# Altium schematic sheet LedSnake.SchDoc
size A4
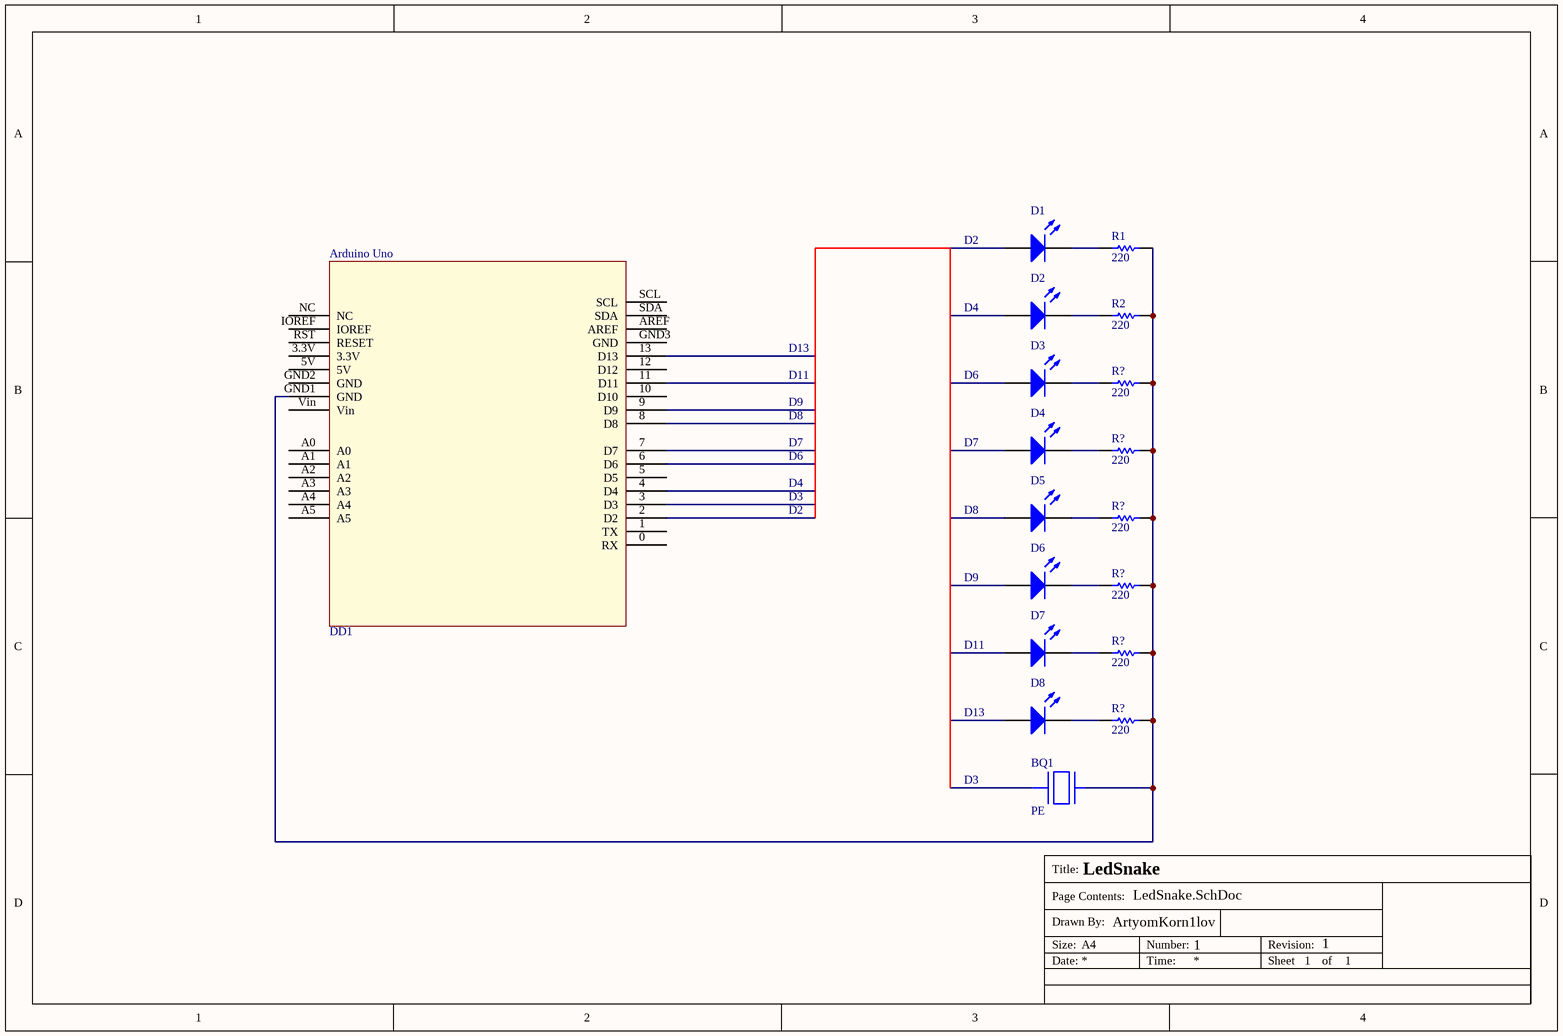
[diagram p0: LedSnake.SchDoc]

## Parts
(Parts that share a designator on the sheet are numbered #1, #2 ... from top to bottom, then left to right.)
Arduino_Uno  DD1  [ARDUINO UNO]
BQ1  PE
D1  Light-Emitting Diode  (value not drawn)
D2  Light-Emitting Diode  (value not drawn)
D3  Light-Emitting Diode  (value not drawn)
D4  Light-Emitting Diode  (value not drawn)
D5  Light-Emitting Diode  (value not drawn)
D6  Light-Emitting Diode  (value not drawn)
D7  Light-Emitting Diode  (value not drawn)
D8  Light-Emitting Diode  (value not drawn)
R1  value 220  (hidden comment: Resistor)
R2  value 220  (hidden comment: Resistor)
R?#1  value 220  (hidden comment: Resistor)
R?#2  value 220  (hidden comment: Resistor)
R?#3  value 220  (hidden comment: Resistor)
R?#4  value 220  (hidden comment: Resistor)
R?#5  value 220  (hidden comment: Resistor)
R?#6  value 220  (hidden comment: Resistor)

## Nets
NetArduino_Uno_GND1: Arduino_Uno.GND1(GND) BQ1.2 R1.2 R2.2 R?#1.2 R?#2.2 R?#3.2 R?#4.2 R?#5.2 R?#6.2
NetD1_2: D1.2(K) R1.1
NetD2_2: D2.2(K) R2.1
NetD3_2: D3.2(K) R?#1.1
NetD4_2: D4.2(K) R?#2.1
NetD5_2: D5.2(K) R?#3.1
NetD6_2: D6.2(K) R?#4.1
NetD7_2: D7.2(K) R?#5.1
NetD8_2: D8.2(K) R?#6.1

Not connected (* = marked no-connect by the designer): Arduino_Uno 0(RX) 1(TX) 2(D2) 3(D3) 3.3V 4(D4) 5(D5) 5V 6(D6) 7(D7) 8(D8) 9(D9) 10(D10) 11(D11) 12(D12) 13(D13) A0 A1 A2 A3 A4 A5 AREF GND2(GND) GND3(GND) IOREF NC RST(RESET) SCL SDA Vin; BQ1 1; D1 1(A); D2 1(A); D3 1(A); D4 1(A); D5 1(A); D6 1(A); D7 1(A); D8 1(A)

## Notes on the sheet
- D2
- D4
- D11
- D13
- D6
- D7
- D8
- D9
- D3
- Title:
- Drawn By:
- Page Contents:
- LedSnake
- Size:
- Date:
- A4
- ArtyomKorn1lov
- Number:
- Time:
- 1
- Revision:
- Sheet
- of

## Library data of the parts
Arduino_Uno = ARDUINO UNO
D1-D8 = LED: AF: 1; BV: 0; BV_MAX: 1e99; EG: 1.11; FC: 0.5; IBV: 0.001; IS: 1e-14; MJSW: 0.33; NTUN: 30; TNOM: 27; XTI: 3; SimulationGenericComponent: True; CJO: 0; CJP: 0; CTA: 0; CTP: 0; FCS: 0.5; FV_MAX: 1e99; IKF: 0; IKR: 0; ISR: 1e-14; JSW: 0; JTUN: 0; JTUNSW: 0; KEG: 1; KF: 0; LEVEL: 1; N: 1; NBV: 1; NR: 1; NS: 1; PHP: 1; RS: 0; TCV: 0; TLEV: 0; TLEVC: 0; TM1: 0; TM2: 0; TPB: 0; TPHP: 0; TRS: 0; TRS2: 0; TT: 0; TTT1: 0; TTT2: 0; VJ: 1; XTITUN: 3
R1 R2 R?#1-R?#6 = Resistor: TC1: 0; SimulationGenericComponent: True; TC2: 0